# EAGLE design ring (EAGLE 7.5.0)
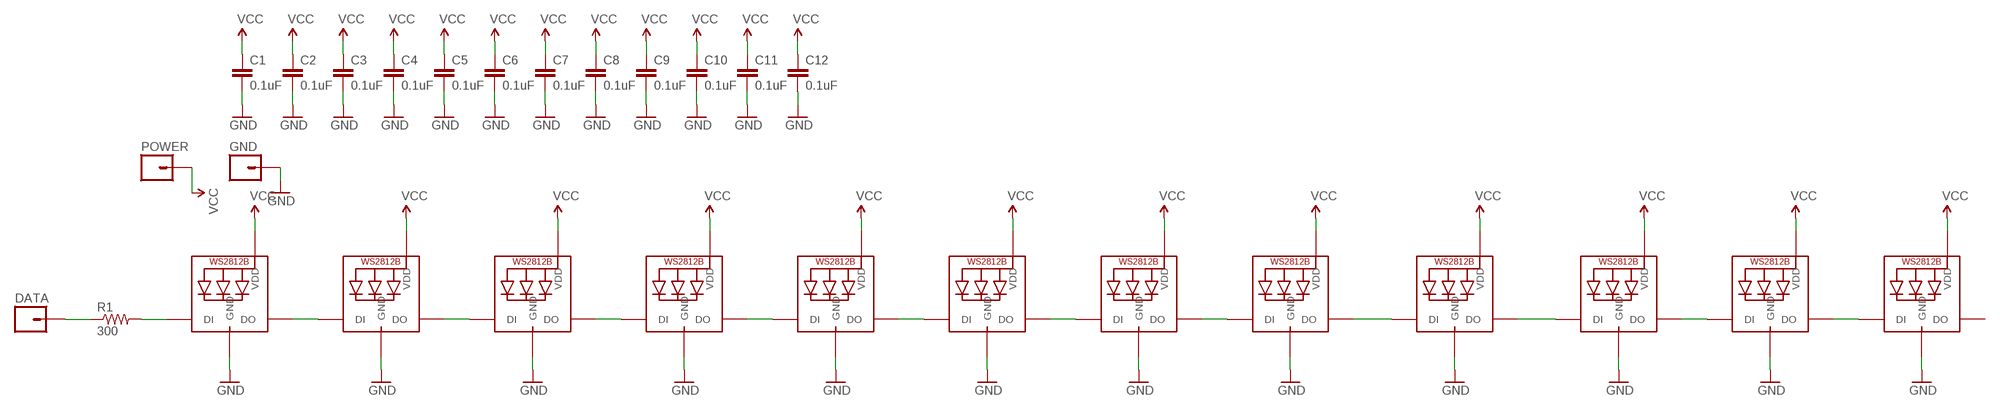
[diagram p0: schematic, sheet 1]

## Parts
C1  0.1uF  0.1UF-25V-5%(0603)  [0603-CAP]
C2  0.1uF  0.1UF-25V-5%(0603)  [0603-CAP]
C3  0.1uF  0.1UF-25V-5%(0603)  [0603-CAP]
C4  0.1uF  0.1UF-25V-5%(0603)  [0603-CAP]
C5  0.1uF  0.1UF-25V-5%(0603)  [0603-CAP]
C6  0.1uF  0.1UF-25V-5%(0603)  [0603-CAP]
C7  0.1uF  0.1UF-25V-5%(0603)  [0603-CAP]
C8  0.1uF  0.1UF-25V-5%(0603)  [0603-CAP]
C9  0.1uF  0.1UF-25V-5%(0603)  [0603-CAP]
C10  0.1uF  0.1UF-25V-5%(0603)  [0603-CAP]
C11  0.1uF  0.1UF-25V-5%(0603)  [0603-CAP]
C12  0.1uF  0.1UF-25V-5%(0603)  [0603-CAP]
DATA  M01PTH  [1X01]
GND  M01PTH  [1X01]
LED1  WS2812B5050  [WS2812B]
LED2  WS2812B5050  [WS2812B]
LED3  WS2812B5050  [WS2812B]
LED4  WS2812B5050  [WS2812B]
LED5  WS2812B5050  [WS2812B]
LED6  WS2812B5050  [WS2812B]
LED7  WS2812B5050  [WS2812B]
LED8  WS2812B5050  [WS2812B]
LED9  WS2812B5050  [WS2812B]
LED10  WS2812B5050  [WS2812B]
LED11  WS2812B5050  [WS2812B]
LED12  WS2812B5050  [WS2812B]
POWER  M01PTH  [1X01]
R1  300  300OHM-1/10W-1%(0603)  [0603-RES]

## Nets
GND: C1.2 C2.2 C3.2 C4.2 C5.2 C6.2 C7.2 C8.2 C9.2 C10.2 C11.2 C12.2 GND.1 LED1.3-GND(GND) LED2.3-GND(GND) LED3.3-GND(GND) LED4.3-GND(GND) LED5.3-GND(GND) LED6.3-GND(GND) LED7.3-GND(GND) LED8.3-GND(GND) LED9.3-GND(GND) LED10.3-GND(GND) LED11.3-GND(GND) LED12.3-GND(GND)
N$1: LED1.4-DIN(DI) R1.2
N$2: DATA.1 R1.1
N$3: LED1.2-DOUT(DO) LED2.4-DIN(DI)
N$4: LED2.2-DOUT(DO) LED3.4-DIN(DI)
N$5: LED3.2-DOUT(DO) LED4.4-DIN(DI)
N$6: LED4.2-DOUT(DO) LED5.4-DIN(DI)
N$7: LED5.2-DOUT(DO) LED6.4-DIN(DI)
N$8: LED6.2-DOUT(DO) LED7.4-DIN(DI)
N$9: LED7.2-DOUT(DO) LED8.4-DIN(DI)
N$10: LED8.2-DOUT(DO) LED9.4-DIN(DI)
N$11: LED9.2-DOUT(DO) LED10.4-DIN(DI)
N$12: LED10.2-DOUT(DO) LED11.4-DIN(DI)
N$13: LED11.2-DOUT(DO) LED12.4-DIN(DI)
VCC: C1.1 C2.1 C3.1 C4.1 C5.1 C6.1 C7.1 C8.1 C9.1 C10.1 C11.1 C12.1 LED1.1-VDD(VDD) LED2.1-VDD(VDD) LED3.1-VDD(VDD) LED4.1-VDD(VDD) LED5.1-VDD(VDD) LED6.1-VDD(VDD) LED7.1-VDD(VDD) LED8.1-VDD(VDD) LED9.1-VDD(VDD) LED10.1-VDD(VDD) LED11.1-VDD(VDD) LED12.1-VDD(VDD) POWER.1
Unconnected: LED12.2-DOUT(DO)

## Library data of the parts
C1-C12 = SparkFun-Capacitors:0.1UF-25V-5%(0603): CAP-08604; PROD_ID: CAP-08604
DATA GND POWER = SparkFun-Connectors:M01: Header 1 Standard 1-pin 0.1" header. Use with straight break away headers (SKU : PRT-00116), right angle break away headers (PRT-00553), swiss pins (PRT-00743), machine pins (PRT-00117), and female headers (PRT-00115). SMTSO-256-ET is a "flush mount" nut for a 4-40 screw. The older package used to be too tight, and did not allow it to sit properly thru the drill hit. The latest (0.165DIA) fits nice and snug.
LED1-LED12 = adafruit:WS2812B
R1 = SparkFun-Resistors:300OHM-1/10W-1%(0603): RES-10328; PROD_ID: RES_10328

## Board
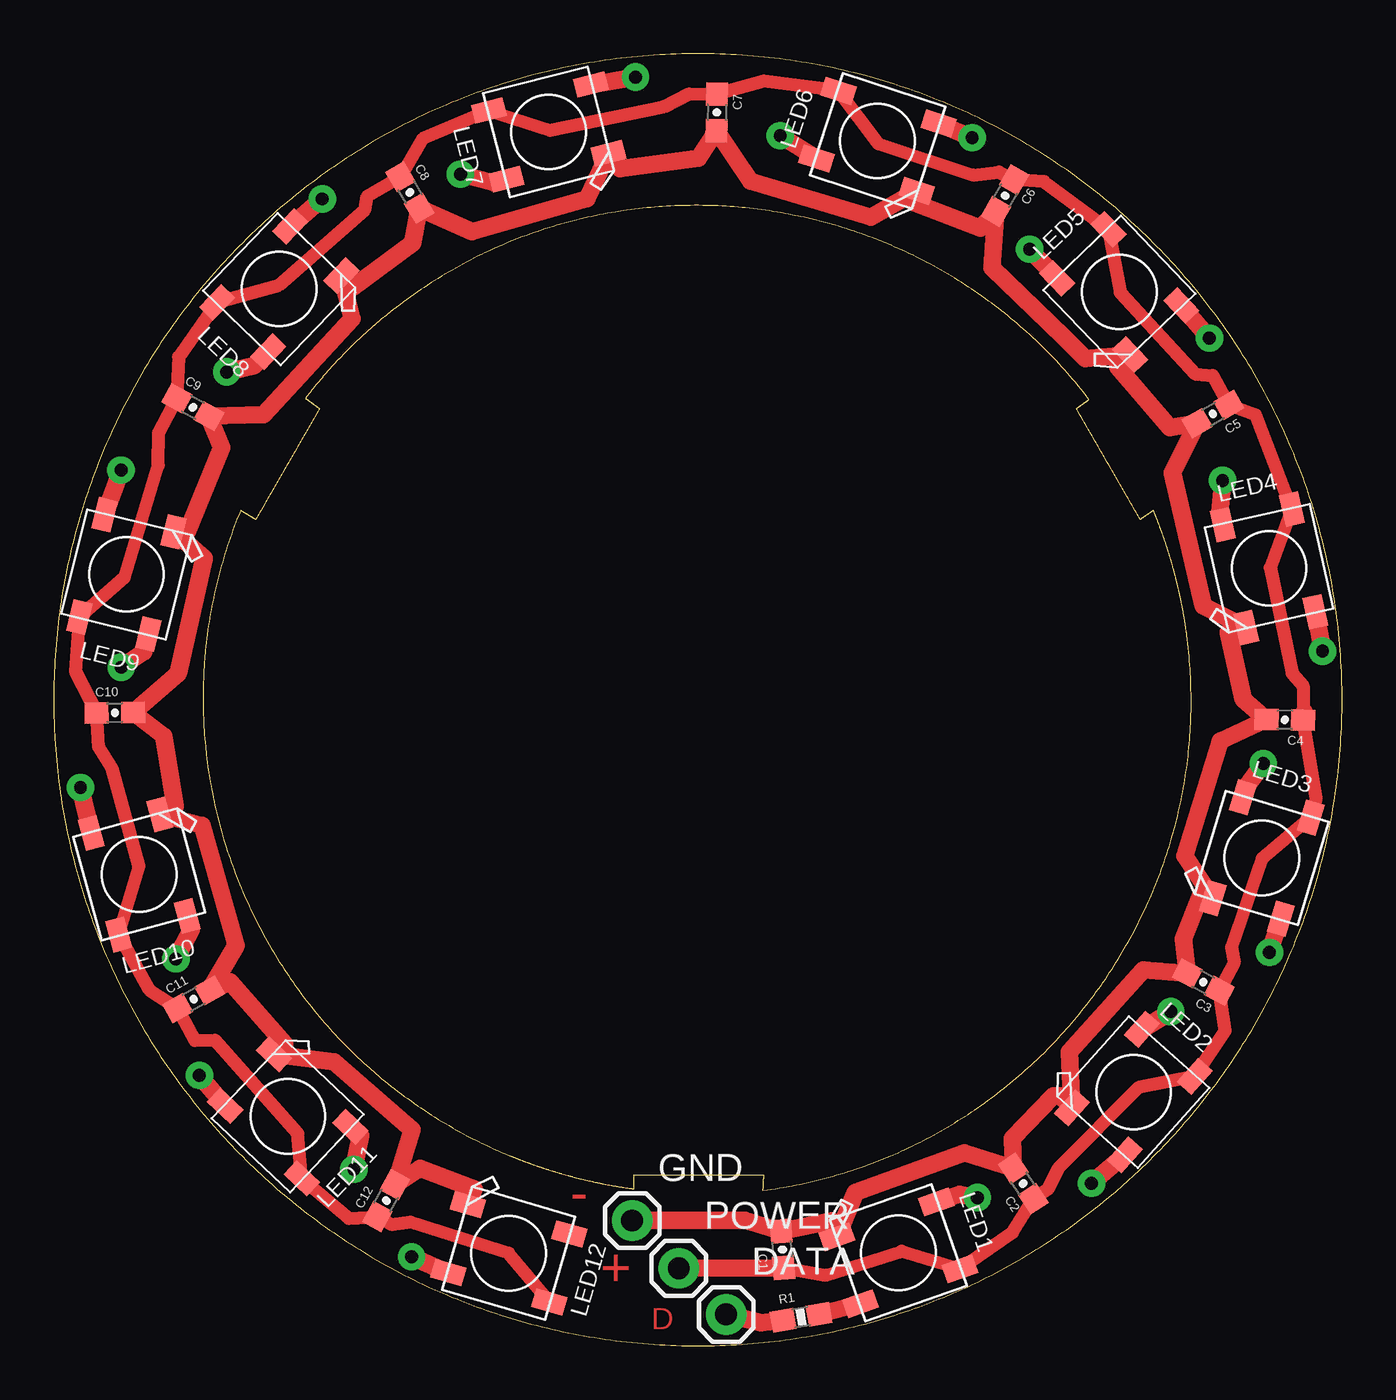
[diagram p1: board, top side]
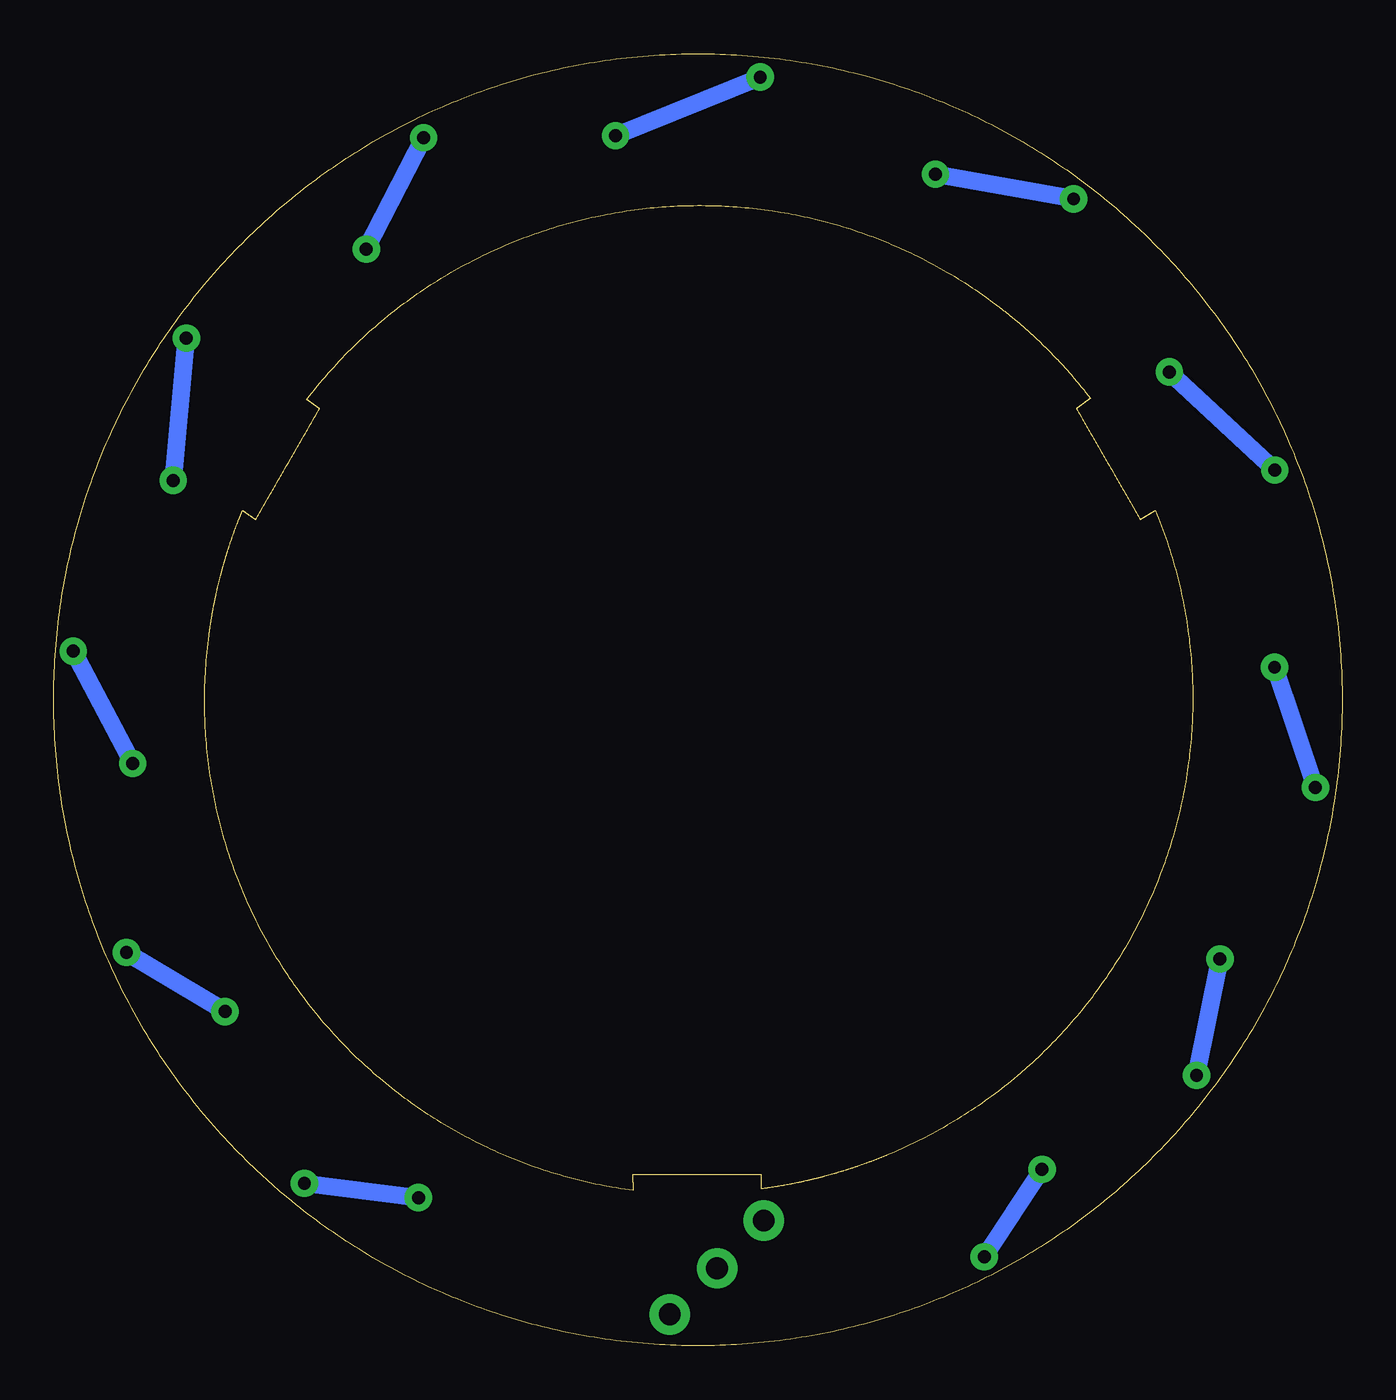
[diagram p2: board, bottom side, seen from below]

Size 59.94 x 60.11 mm. Coordinates in mm from the lower left corner, seen from the top.
Outline: 52.72,33.06 52.72,33.09 52.71,33.12 52.71,33.15 52.7,33.18 52.7,33.21 52.69,33.24 52.68,33.34 52.68,33.37 52.67,33.4 52.67,33.43 52.66,33.46 52.66,33.49 52.65,33.52 52.65,33.56 52.64,33.59 52.64,33.62 52.63,33.65 52.63,33.68 52.62,33.71 52.62,33.74 52.61,33.77 52.6,33.83 52.6,33.87 52.59,33.9 52.59,33.93 52.58,33.96 52.58,33.99 52.57,34.02 52.57,34.05 52.56,34.08 52.56,34.11 52.55,34.14 52.54,34.18 52.54,34.21 52.53,34.24 52.53,34.27 52.52,34.3 52.52,34.33 52.51,34.36 52.5,34.39 52.5,34.42 52.49,34.45 52.49,34.48 52.48,34.51 52.47,34.55 52.47,34.58 52.46,34.61 52.45,34.64 52.45,34.67 52.44,34.7 52.44,34.73 52.43,34.76 52.42,34.79 52.42,34.82 52.41,34.85 52.4,34.88 52.4,34.91 52.39,34.95 52.38,34.98 52.38,35.01 52.37,35.04 52.36,35.07 52.36,35.1 52.35,35.13 52.34,35.16 52.34,35.19 52.33,35.22 52.32,35.25 52.31,35.31 52.29,35.37 52.29,35.4 52.28,35.44 52.27,35.47 52.26,35.5 52.26,35.53 52.25,35.56 52.24,35.59 52.23,35.62 52.23,35.65 52.22,35.68 52.21,35.71 52.2,35.74 52.2,35.77 52.19,35.8 52.18,35.83 52.17,35.86 52.16,35.89 52.16,35.92 52.15,35.95 52.14,35.98 52.13,36.01 52.12,36.04 52.12,36.07 52.11,36.1 52.1,36.13 52.09,36.16 52.07,36.23 52.06,36.26 52.06,36.29 52.05,36.32 52.04,36.35 52.02,36.41 52.01,36.44 52,36.47 52,36.5 51.99,36.53 51.98,36.56 51.97,36.59 51.95,36.65 51.94,36.68 51.93,36.71 51.92,36.74 51.92,36.77 51.91,36.8 51.9,36.83 51.89,36.86 51.88,36.89 51.87,36.92 51.86,36.95 51.85,36.98 51.84,37.01 51.83,37.04 51.82,37.07 51.81,37.1 51.8,37.13 51.79,37.16 51.78,37.19 51.77,37.22 51.76,37.25 51.74,37.31 51.73,37.34 51.67,37.52 51.66,37.54 51.65,37.57 51.64,37.6 51.63,37.63 51.62,37.66 51.6,37.72 51.59,37.75 51.58,37.78 51.57,37.81 51.56,37.84 51.55,37.87 51.54,37.9 51.53,37.93 51.52,37.96 51.51,37.99 51.5,38.02 51.48,38.05 51.47,38.08 51.46,38.11 51.45,38.14 51.43,38.2 51.42,38.22 51.41,38.25 51.4,38.28 51.37,38.34 51.36,38.37 51.34,38.43 51.33,38.46 51.32,38.49 51.3,38.52 51.29,38.55 51.28,38.58 51.27,38.61 51.26,38.63 51.25,38.66 51.23,38.69 51.22,38.72 51.21,38.75 51.2,38.78 51.19,38.81 51.18,38.84 51.16,38.87 51.15,38.86 51.14,38.85 51.13,38.85 51.12,38.84 51.12,38.83 51.11,38.83 51.1,38.82 51.09,38.81 51.07,38.8 51.06,38.79 51.05,38.79 51.03,38.77 51.02,38.77 51.01,38.76 51,38.75 50.99,38.75 50.96,38.73 50.95,38.72 50.94,38.71 50.92,38.7 50.91,38.69 50.9,38.69 50.89,38.68 50.88,38.67 50.86,38.66 50.85,38.65 50.84,38.65 50.81,38.62 50.8,38.61 50.77,38.59 50.76,38.59 50.75,38.58 50.74,38.57 50.73,38.57 50.72,38.56 50.71,38.55 50.7,38.55 50.69,38.54 50.68,38.53 50.66,38.52 50.65,38.51 50.64,38.51 50.63,38.5 50.61,38.49 50.6,38.48 50.59,38.47 50.58,38.47 50.56,38.45 50.55,38.44 50.5,38.52 50.45,38.6 50.41,38.68 50.36,38.76 50.31,38.84 50.22,39 50.18,39.08 50.13,39.16 50.04,39.33 49.99,39.41 49.94,39.49 49.85,39.65 49.8,39.73 49.76,39.81 49.71,39.89 49.67,39.97 49.62,40.05 49.57,40.13 49.48,40.29 49.43,40.38 49.39,40.46 49.34,40.54 49.3,40.62 49.25,40.7 49.2,40.78 49.11,40.94 49.06,41.02 49.02,41.1 48.92,41.26 48.88,41.34 48.83,41.42 48.79,41.51 48.74,41.59 48.65,41.75 48.6,41.83 48.55,41.91 48.51,41.99 48.46,42.07 48.37,42.23 48.32,42.31 48.28,42.39 48.23,42.47 48.18,42.55 48.14,42.64 48.09,42.72 48,42.88 47.95,42.96 47.91,43.04 47.81,43.2 47.77,43.28 47.68,43.44 47.63,43.52 47.58,43.6 47.59,43.61 47.6,43.62 47.61,43.62 47.62,43.63 47.63,43.64 47.64,43.64 47.65,43.65 47.66,43.66 47.67,43.66 47.67,43.67 47.68,43.68 47.69,43.68 47.7,43.69 47.71,43.7 47.72,43.7 47.73,43.71 47.74,43.72 47.75,43.72 47.76,43.73 47.77,43.74 47.78,43.74 47.78,43.75 47.79,43.76 47.8,43.76 47.81,43.77 47.82,43.78 47.83,43.78 47.84,43.79 47.85,43.8 47.86,43.8 47.87,43.81 47.88,43.82 47.89,43.82 47.9,43.83 47.9,43.84 47.91,43.84 47.92,43.85 47.93,43.86 47.94,43.86 47.95,43.87 47.96,43.88 47.97,43.88 47.98,43.89 47.99,43.9 48,43.9 48.01,43.91 48.02,43.92 48.02,43.92 48.03,43.93 48.04,43.94 48.05,43.94 48.06,43.95 48.07,43.96 48.08,43.96 48.09,43.97 48.1,43.98 48.11,43.98 48.12,43.99 48.13,44 48.14,44 48.14,44.01 48.15,44.02 48.16,44.02 48.17,44.03 48.05,44.19 47.93,44.34 47.8,44.5 47.68,44.65 47.55,44.8 47.43,44.95 47.3,45.1 47.17,45.25 47.04,45.39 46.91,45.54 46.78,45.68 46.64,45.82 46.51,45.97 46.38,46.11 46.24,46.24 46.1,46.38 45.97,46.52 45.83,46.65 45.69,46.78 45.55,46.91 45.41,47.04 45.26,47.17 45.12,47.3 44.98,47.43 44.83,47.55 44.69,47.67 44.54,47.8 44.39,47.92 44.24,48.04 44.09,48.15 43.94,48.27 43.79,48.39 43.64,48.5 43.49,48.61 43.34,48.72 43.18,48.83 43.03,48.94 42.87,49.05 42.72,49.15 42.56,49.26 42.4,49.36 42.25,49.46 42.09,49.56 41.93,49.66 41.77,49.76 41.61,49.85 41.44,49.95 41.28,50.04 41.12,50.13 40.96,50.22 40.79,50.31 40.63,50.4 40.46,50.49 40.13,50.65 39.96,50.74 39.8,50.82 39.63,50.9 39.46,50.97 39.29,51.05 39.12,51.13 38.95,51.2 38.78,51.27 38.61,51.34 38.44,51.41 38.27,51.48 38.09,51.55 37.92,51.61 37.75,51.67 37.57,51.74 37.4,51.8 37.22,51.86 37.05,51.91 36.87,51.97 36.7,52.03 36.52,52.08 36.34,52.13 35.99,52.23 35.81,52.28 35.63,52.33 35.45,52.37 35.27,52.42 35.1,52.46 34.92,52.5 34.74,52.54 34.38,52.61 34.2,52.65 34.01,52.68 33.83,52.71 33.65,52.75 33.47,52.77 33.29,52.8 33.11,52.83 32.92,52.85 32.74,52.88 32.56,52.9 32.38,52.92 32.19,52.94 32.01,52.96 31.83,52.97 31.65,52.99 31.46,53 31.28,53.01 31.09,53.02 30.91,53.03 30.73,53.04 30.54,53.05 30.36,53.05 30.18,53.05 29.99,53.06 29.81,53.06 29.62,53.05 29.44,53.05 29.26,53.05 29.07,53.04 28.89,53.04 28.7,53.03 28.52,53.02 28.33,53.01 28.15,52.99 27.97,52.98 27.78,52.96 27.6,52.94 27.42,52.92 27.23,52.9 27.05,52.88 26.87,52.86 26.68,52.83 26.5,52.81 26.13,52.75 25.95,52.72 25.77,52.69 25.59,52.65 25.4,52.62 25.22,52.58 25.04,52.54 24.86,52.5 24.68,52.46 24.5,52.42 24.31,52.37 23.95,52.28 23.77,52.23 23.59,52.18 23.41,52.13 23.24,52.08 23.06,52.02 22.88,51.96 22.7,51.91 22.52,51.85 22.34,51.78 22.17,51.72 21.99,51.66 21.81,51.59 21.64,51.53 21.46,51.46 21.29,51.39 21.11,51.31 20.94,51.24 20.76,51.17 20.59,51.09 20.24,50.93 20.07,50.85 19.9,50.77 19.73,50.69 19.56,50.6 19.39,50.51 19.22,50.42 19.05,50.33 18.88,50.24 18.71,50.15 18.55,50.05 18.38,49.96 18.21,49.86 18.05,49.76 17.88,49.66 17.72,49.56 17.55,49.45 17.39,49.35 17.23,49.24 17.06,49.13 16.9,49.02 16.74,48.91 16.58,48.79 16.26,48.56 16.11,48.44 15.95,48.32 15.92,48.3 15.9,48.29 15.87,48.27 15.85,48.25 15.82,48.23 15.8,48.21 15.77,48.19 15.75,48.17 15.73,48.15 15.7,48.13 15.68,48.11 15.65,48.09 15.63,48.07 15.6,48.05 15.58,48.03 15.55,48.01 15.53,47.99 15.48,47.96 15.46,47.94 15.43,47.92 15.41,47.9 15.38,47.88 15.33,47.84 15.24,47.76 15.21,47.74 15.19,47.72 15.17,47.7 15.12,47.66 15.09,47.64 15.07,47.61 15.05,47.59 15.02,47.57 15,47.55 14.98,47.53 14.95,47.51 14.93,47.49 14.9,47.47 14.88,47.45 14.86,47.43 14.83,47.41 14.81,47.39 14.79,47.37 14.76,47.35 14.74,47.33 14.72,47.31 14.69,47.29 14.67,47.27 14.65,47.25 14.62,47.22 14.6,47.2 14.58,47.18 14.55,47.16 14.53,47.14 14.51,47.12 14.46,47.08 14.44,47.06 14.41,47.04 14.39,47.01 14.37,46.99 14.34,46.97 14.32,46.95 14.3,46.93 14.28,46.91 14.25,46.89 14.23,46.86 14.21,46.84 14.18,46.82 14.14,46.78 14.12,46.76 14.09,46.74 14.07,46.71 14.05,46.69 14.03,46.67 14,46.65 13.98,46.63 13.96,46.61 13.94,46.58 13.91,46.56 13.89,46.54 13.87,46.52 13.85,46.5 13.82,46.47 13.8,46.45 13.78,46.43 13.76,46.41 13.74,46.39 13.69,46.34 13.67,46.32 13.65,46.3 13.62,46.28 13.6,46.25 13.58,46.23 13.56,46.21 13.54,46.19 13.52,46.16 13.49,46.14 13.47,46.12 13.45,46.1 13.43,46.07 13.41,46.05 13.34,45.98 13.32,45.96 13.3,45.94 13.28,45.92 13.26,45.89 13.23,45.87 13.21,45.85 13.19,45.82 13.17,45.8 13.13,45.76 13.11,45.73 13.08,45.71 13.04,45.66 13.02,45.64 13,45.62 12.98,45.6 12.96,45.57 12.94,45.55 12.92,45.53 12.89,45.5 12.87,45.48 12.85,45.46 12.83,45.43 12.81,45.41 12.79,45.39 12.77,45.36 12.75,45.34 12.73,45.32 12.71,45.29 12.69,45.27 12.67,45.25 12.65,45.22 12.62,45.2 12.6,45.17 12.58,45.15 12.56,45.13 12.54,45.1 12.52,45.08 12.5,45.06 12.48,45.03 12.46,45.01 12.44,44.98 12.42,44.96 12.4,44.94 12.38,44.91 12.36,44.89 12.34,44.86 12.32,44.84 12.3,44.82 12.28,44.79 12.26,44.77 12.24,44.74 12.22,44.72 12.12,44.6 12.1,44.57 12.08,44.55 12.06,44.53 12.02,44.48 12,44.45 11.96,44.4 11.94,44.38 11.92,44.35 11.91,44.33 11.89,44.3 11.87,44.28 11.85,44.26 11.83,44.23 11.81,44.21 11.79,44.18 11.77,44.16 11.75,44.13 11.73,44.11 11.71,44.08 11.72,44.07 11.73,44.07 11.74,44.06 11.75,44.05 11.76,44.04 11.77,44.04 11.78,44.03 11.8,44.01 11.81,44.01 11.82,44 11.83,43.99 11.84,43.98 11.85,43.98 11.86,43.97 11.88,43.96 11.89,43.95 11.9,43.95 11.91,43.94 11.92,43.93 11.93,43.92 11.94,43.92 11.95,43.91 11.96,43.9 11.97,43.89 11.98,43.89 11.99,43.88 12,43.87 12.01,43.86 12.02,43.86 12.03,43.85 12.04,43.84 12.05,43.84 12.06,43.83 12.07,43.82 12.08,43.81 12.09,43.81 12.1,43.8 12.11,43.79 12.12,43.78 12.13,43.78 12.14,43.77 12.15,43.76 12.16,43.75 12.17,43.75 12.18,43.74 12.19,43.73 12.2,43.72 12.21,43.72 12.22,43.71 12.23,43.7 12.25,43.69 12.26,43.68 12.27,43.67 12.28,43.66 12.29,43.66 12.3,43.65 12.31,43.64 12.32,43.63 12.33,43.63 12.34,43.62 12.35,43.61 12.36,43.6 12.31,43.52 12.27,43.44 12.22,43.36 12.13,43.2 12.08,43.12 12.04,43.04 11.99,42.96 11.94,42.88 11.9,42.8 11.85,42.72 11.81,42.64 11.76,42.55 11.71,42.47 11.67,42.39 11.62,42.31 11.57,42.23 11.53,42.15 11.48,42.07 11.44,41.99 11.39,41.91 11.34,41.83 11.3,41.75 11.2,41.59 11.16,41.51 11.11,41.42 11.06,41.34 11.02,41.26 10.97,41.18 10.93,41.1 10.88,41.02 10.83,40.94 10.79,40.86 10.74,40.78 10.65,40.62 10.6,40.54 10.56,40.46 10.51,40.38 10.46,40.29 10.42,40.21 10.37,40.13 10.32,40.05 10.28,39.97 10.23,39.89 10.19,39.81 10.09,39.65 10.05,39.57 10,39.49 9.95,39.41 9.91,39.33 9.86,39.25 9.81,39.16 9.72,39 9.63,38.84 9.58,38.76 9.54,38.68 9.49,38.6 9.44,38.52 9.4,38.44 9.39,38.45 9.36,38.46 9.35,38.47 9.34,38.47 9.33,38.48 9.32,38.49 9.31,38.49 9.3,38.5 9.29,38.51 9.28,38.51 9.27,38.52 9.25,38.53 9.24,38.53 9.23,38.54 9.22,38.55 9.21,38.55 9.19,38.57 9.18,38.57 9.17,38.58 9.16,38.59 9.14,38.59 9.13,38.6 9.12,38.61 9.11,38.61 9.1,38.62 9.09,38.63 9.08,38.63 9.07,38.64 9.06,38.64 9.05,38.65 9.03,38.66 9.02,38.66 9.01,38.67 9,38.68 8.99,38.68 8.98,38.69 8.97,38.7 8.96,38.7 8.95,38.71 8.94,38.72 8.92,38.72 8.91,38.73 8.9,38.74 8.89,38.74 8.88,38.75 8.87,38.76 8.86,38.76 8.85,38.77 8.84,38.78 8.83,38.78 8.81,38.79 8.8,38.8 8.79,38.8 8.78,38.81 8.77,38.82 8.75,38.83 8.74,38.84 8.73,38.84 8.72,38.85 8.7,38.86 8.69,38.86 8.62,38.68 8.54,38.5 8.47,38.31 8.4,38.13 8.34,37.95 8.27,37.76 8.2,37.58 8.14,37.39 8.08,37.21 8.02,37.02 7.96,36.84 7.91,36.65 7.85,36.47 7.8,36.28 7.75,36.09 7.7,35.91 7.65,35.72 7.6,35.53 7.56,35.35 7.51,35.16 7.47,34.97 7.43,34.79 7.39,34.6 7.36,34.41 7.32,34.23 7.29,34.04 7.26,33.85 7.23,33.66 7.2,33.48 7.17,33.29 7.14,33.1 7.12,32.91 7.1,32.73 7.08,32.54 7.06,32.35 7.02,31.98 7.01,31.79 7,31.6 6.98,31.41 6.97,31.23 6.97,31.04 6.96,30.85 6.95,30.67 6.95,30.48 6.95,30.29 6.95,30.11 6.95,29.73 6.96,29.55 6.96,29.36 6.97,29.18 6.98,28.99 6.99,28.8 7,28.62 7.01,28.43 7.03,28.25 7.04,28.06 7.06,27.88 7.1,27.51 7.12,27.33 7.14,27.14 7.17,26.96 7.19,26.78 7.25,26.41 7.28,26.23 7.32,26.05 7.35,25.87 7.38,25.69 7.42,25.51 7.46,25.33 7.5,25.15 7.54,24.97 7.58,24.79 7.62,24.61 7.67,24.43 7.72,24.25 7.76,24.07 7.81,23.9 7.86,23.72 7.92,23.54 8.02,23.19 8.08,23.02 8.14,22.84 8.2,22.67 8.26,22.49 8.32,22.32 8.38,22.15 8.45,21.98 8.58,21.63 8.65,21.46 8.72,21.29 8.79,21.12 8.86,20.96 8.94,20.79 9.01,20.62 9.09,20.45 9.17,20.29 9.25,20.12 9.33,19.95 9.41,19.79 9.49,19.63 9.58,19.46 9.67,19.3 9.75,19.14 9.84,18.98 9.93,18.82 10.02,18.66 10.11,18.5 10.21,18.34 10.3,18.18 10.4,18.02 10.5,17.87 10.6,17.71 10.7,17.56 10.9,17.25 11,17.1 11.11,16.94 11.22,16.79 11.32,16.64 11.43,16.49 11.54,16.34 11.65,16.2 11.77,16.05 11.88,15.9 12,15.76 12.11,15.61 12.23,15.47 12.35,15.33 12.47,15.19 12.59,15.04 12.71,14.9 12.84,14.77 12.96,14.63 13.09,14.49 13.21,14.35 13.34,14.22 13.47,14.08 13.6,13.95 13.73,13.82 13.87,13.69 14,13.56 14.14,13.43 14.27,13.3 14.41,13.17 14.55,13.04 14.69,12.92 14.97,12.67 15.12,12.55 15.26,12.43 15.41,12.31 15.56,12.19 15.7,12.07 15.85,11.95 16,11.84 16.15,11.73 16.31,11.61 16.46,11.5 16.62,11.39 16.77,11.28 16.93,11.17 17.09,11.06 17.24,10.96 17.4,10.85 17.57,10.75 17.73,10.64 17.89,10.54 18.06,10.44 18.22,10.34 18.39,10.24 18.56,10.15 18.72,10.05 18.89,9.96 19.07,9.87 19.24,9.77 19.41,9.68 19.76,9.51 19.94,9.42 20.11,9.34 20.29,9.25 20.47,9.17 20.65,9.09 20.83,9.01 21.01,8.93 21.2,8.86 21.23,8.84 21.25,8.83 21.28,8.82 21.31,8.81 21.34,8.8 21.37,8.78 21.4,8.77 21.43,8.76 21.46,8.75 21.49,8.74 21.52,8.73 21.55,8.72 21.58,8.7 21.6,8.69 21.63,8.68 21.66,8.67 21.69,8.66 21.72,8.65 21.78,8.62 21.81,8.61 21.84,8.6 21.87,8.59 21.9,8.58 21.93,8.57 21.96,8.56 21.99,8.55 22.02,8.54 22.05,8.52 22.08,8.51 22.1,8.5 22.13,8.49 22.16,8.48 22.19,8.47 22.22,8.46 22.28,8.44 22.31,8.43 22.34,8.42 22.37,8.41 22.46,8.38 22.49,8.37 22.52,8.36 22.55,8.35 22.58,8.34 22.61,8.33 22.64,8.32 22.67,8.31 22.7,8.3 22.73,8.29 22.76,8.28 22.79,8.27 22.82,8.26 22.85,8.25 22.88,8.24 22.91,8.23 22.94,8.22 22.97,8.21 23,8.2 23.03,8.19 23.06,8.18 23.09,8.17 23.12,8.16 23.18,8.14 23.21,8.13 23.24,8.12 23.27,8.11 23.3,8.1 23.33,8.09 23.36,8.09 23.42,8.07 23.45,8.06 23.51,8.04 23.54,8.03 23.57,8.02 23.6,8.01 23.63,8.01 23.66,8 23.72,7.98 23.75,7.97 23.81,7.95 23.84,7.95 23.9,7.93 23.93,7.92 23.96,7.91 23.99,7.9 24.02,7.9 24.05,7.89 24.08,7.88 24.11,7.87 24.14,7.86 24.17,7.86 24.2,7.85 24.23,7.84 24.26,7.83 24.29,7.82 24.32,7.82 24.35,7.81 24.39,7.8 24.42,7.79 24.45,7.79 24.48,7.78 24.51,7.77 24.54,7.76 24.57,7.76 24.6,7.75 24.63,7.74 24.66,7.73 24.69,7.73 24.72,7.72 24.75,7.71 24.78,7.7 24.81,7.7 24.84,7.69 24.87,7.68 24.9,7.68 24.93,7.67 24.97,7.66 25.03,7.65 25.06,7.64 25.09,7.63 25.12,7.63 25.15,7.62 25.18,7.62 25.21,7.61 25.24,7.6 25.27,7.6 25.3,7.59 25.33,7.58 25.36,7.58 25.4,7.57 25.43,7.56 25.46,7.56 25.49,7.55 25.52,7.55 25.55,7.54 25.58,7.53 25.61,7.53 25.64,7.52 25.67,7.51 25.7,7.51 25.77,7.5 25.8,7.49 25.83,7.49 25.86,7.48 25.92,7.47 25.95,7.46 25.98,7.46 26.01,7.45 26.04,7.45 26.11,7.44 26.14,7.43 26.17,7.43 26.2,7.42 26.23,7.42 26.26,7.41 26.29,7.4 26.32,7.4 26.35,7.39 26.38,7.39 26.42,7.38 26.45,7.38 26.48,7.38 26.51,7.37 26.54,7.37 26.6,7.36 26.63,7.35 26.66,7.35 26.7,7.34 26.73,7.34 26.76,7.33 26.79,7.33 26.82,7.32 26.85,7.32 26.88,7.32 26.91,7.31 26.94,7.31 26.98,7.3 27.01,7.3 27.01,7.31 27.01,7.41 27.01,7.42 27.01,7.43 27.01,7.54 27.01,7.55 27.01,7.56 27.01,7.7 27.01,7.71 27.01,7.72 27.01,7.82 27.01,7.83 27.01,7.85 27.01,7.95 27.01,7.96 33.02,7.96 33.02,7.95 33.02,7.94 33.02,7.92 33.02,7.91 33.02,7.9 33.02,7.89 33.02,7.88 33.02,7.87 33.01,7.86 33.01,7.84 33.01,7.83 33.01,7.82 33.01,7.81 33.01,7.8 33.01,7.79 33.01,7.78 33.01,7.76 33.01,7.75 33.01,7.74 33.01,7.72 33.01,7.71 33.01,7.7 33.01,7.68 33.01,7.67 33,7.66 33,7.65 33,7.64 33,7.62 33,7.6 33,7.59 33,7.58 33,7.57 33,7.56 33,7.55 33,7.53 33,7.52 33,7.51 33,7.5 33,7.49 33,7.48 32.99,7.47 32.99,7.44 32.99,7.43 32.99,7.42 32.99,7.41 32.99,7.4 32.99,7.39 32.99,7.37 32.99,7.36 32.99,7.35 32.99,7.34 32.99,7.33 32.99,7.31 32.99,7.29 32.99,7.28 32.99,7.27 32.98,7.26 32.98,7.25 32.98,7.24 32.98,7.23 33.18,7.25 33.37,7.28 33.57,7.31 33.76,7.34 33.96,7.37 34.34,7.44 34.53,7.48 34.72,7.52 34.92,7.56 35.1,7.6 35.29,7.65 35.48,7.69 35.67,7.74 35.86,7.79 36.04,7.84 36.23,7.89 36.41,7.95 36.6,8 36.78,8.05 36.96,8.11 37.15,8.17 37.33,8.23 37.69,8.36 37.87,8.42 38.04,8.49 38.22,8.55 38.4,8.62 38.57,8.69 38.75,8.76 38.92,8.84 39.27,8.99 39.44,9.06 39.61,9.14 39.78,9.22 39.95,9.3 40.12,9.39 40.29,9.47 40.46,9.55 40.62,9.64 40.79,9.73 40.95,9.82 41.12,9.91 41.28,10 41.44,10.09 41.6,10.19 41.76,10.28 41.92,10.38 42.08,10.48 42.24,10.58 42.39,10.68 42.55,10.78 42.7,10.88 42.86,10.98 43.01,11.09 43.16,11.19 43.31,11.3 43.46,11.41 43.61,11.52 43.76,11.63 43.91,11.74 44.05,11.86 44.2,11.97 44.34,12.09 44.49,12.2 44.63,12.32 44.77,12.44 44.91,12.56 45.05,12.68 45.19,12.8 45.32,12.92 45.46,13.05 45.6,13.17 45.73,13.3 45.86,13.43 46.13,13.68 46.26,13.82 46.39,13.95 46.51,14.08 46.64,14.21 46.77,14.35 46.89,14.48 47.01,14.62 47.14,14.76 47.26,14.89 47.38,15.03 47.5,15.17 47.61,15.31 47.73,15.46 47.85,15.6 47.96,15.74 48.07,15.89 48.3,16.18 48.41,16.33 48.52,16.48 48.62,16.62 48.73,16.77 48.84,16.93 48.94,17.08 49.04,17.23 49.14,17.38 49.24,17.54 49.34,17.69 49.44,17.85 49.54,18.01 49.63,18.16 49.73,18.32 49.82,18.48 49.91,18.64 50,18.8 50.09,18.96 50.18,19.12 50.27,19.29 50.35,19.45 50.44,19.61 50.52,19.78 50.6,19.94 50.68,20.11 50.76,20.28 50.84,20.45 50.91,20.61 50.99,20.78 51.06,20.95 51.13,21.12 51.2,21.29 51.28,21.47 51.34,21.64 51.41,21.81 51.48,21.99 51.54,22.16 51.6,22.33 51.66,22.51 51.72,22.69 51.78,22.86 51.84,23.04 51.9,23.22 51.95,23.4 52,23.57 52.05,23.75 52.15,24.11 52.2,24.3 52.25,24.48 52.29,24.66 52.33,24.84 52.37,25.02 52.42,25.21 52.45,25.39 52.49,25.58 52.53,25.76 52.56,25.95 52.59,26.13 52.62,26.32 52.65,26.51 52.68,26.69 52.71,26.88 52.73,27.07 52.76,27.26 52.78,27.44 52.8,27.63 52.82,27.82 52.84,28.01 52.85,28.2 52.86,28.39 52.88,28.59 52.89,28.78 52.9,28.97 52.91,29.16 52.91,29.35 52.92,29.55 52.92,29.74 52.92,29.93 52.92,30.12 52.92,30.32 52.92,30.51 52.91,30.71 52.9,30.9 52.9,31.1 52.88,31.29 52.87,31.49 52.86,31.68 52.84,31.88 52.83,32.07 52.81,32.27 52.79,32.47 52.77,32.66 52.75,32.86 52.72,33.06
Outline: 29.71,60.11 29.46,60.11 29.2,60.1 28.94,60.1 28.68,60.09 28.43,60.07 28.17,60.06 27.92,60.04 27.67,60.03 27.41,60.01 27.16,59.98 26.91,59.96 26.66,59.93 26.4,59.9 26.15,59.87 25.9,59.84 25.66,59.8 25.41,59.77 25.16,59.73 24.91,59.69 24.67,59.64 24.42,59.6 24.18,59.55 23.93,59.5 23.69,59.45 23.44,59.4 23.2,59.34 22.96,59.29 22.72,59.23 22.24,59.11 22,59.04 21.77,58.97 21.53,58.91 21.29,58.84 21.06,58.76 20.82,58.69 20.59,58.61 20.36,58.53 20.13,58.46 19.9,58.37 19.67,58.29 19.44,58.21 19.21,58.12 18.98,58.03 18.75,57.94 18.53,57.85 18.31,57.75 18.08,57.66 17.86,57.56 17.64,57.46 17.42,57.36 17.2,57.26 16.98,57.15 16.76,57.04 16.54,56.94 16.33,56.83 16.11,56.71 15.9,56.6 15.69,56.49 15.47,56.37 15.26,56.25 15.05,56.13 14.84,56.01 14.64,55.89 14.43,55.76 14.22,55.64 14.02,55.51 13.82,55.38 13.61,55.25 13.41,55.11 13.21,54.98 13.01,54.85 12.82,54.71 12.62,54.57 12.43,54.43 12.23,54.29 12.04,54.14 11.85,54 11.66,53.85 11.47,53.7 11.28,53.55 11.09,53.4 10.72,53.1 10.54,52.94 10.36,52.78 10.18,52.63 10,52.47 9.82,52.31 9.64,52.14 9.47,51.98 9.12,51.65 8.95,51.48 8.78,51.31 8.61,51.14 8.44,50.97 8.28,50.79 8.11,50.62 7.95,50.44 7.79,50.27 7.62,50.09 7.47,49.91 7.31,49.73 7.15,49.54 7,49.36 6.84,49.18 6.69,48.99 6.54,48.8 6.24,48.42 6.1,48.23 5.95,48.04 5.81,47.85 5.67,47.65 5.53,47.46 5.39,47.26 5.25,47.06 4.98,46.66 4.85,46.46 4.72,46.26 4.59,46.05 4.46,45.85 4.34,45.64 4.21,45.44 4.09,45.23 3.97,45.02 3.85,44.81 3.73,44.6 3.5,44.17 3.39,43.96 3.28,43.74 3.17,43.52 3.06,43.31 2.96,43.09 2.85,42.87 2.75,42.65 2.65,42.43 2.55,42.2 2.45,41.98 2.36,41.76 2.26,41.53 2.17,41.31 2.08,41.08 1.99,40.85 1.9,40.62 1.82,40.39 1.73,40.16 1.65,39.93 1.57,39.7 1.5,39.46 1.42,39.23 1.35,38.99 1.27,38.76 1.2,38.52 1.14,38.29 1.07,38.05 1.01,37.81 0.94,37.57 0.88,37.33 0.82,37.09 0.77,36.84 0.71,36.6 0.66,36.36 0.61,36.11 0.56,35.87 0.51,35.62 0.47,35.38 0.42,35.13 0.38,34.88 0.35,34.63 0.31,34.39 0.27,34.14 0.24,33.88 0.21,33.63 0.18,33.38 0.15,33.13 0.13,32.88 0.11,32.62 0.09,32.37 0.07,32.11 0.05,31.86 0.04,31.6 0.03,31.35 0.02,31.09 0.01,30.83 0,30.57 0,30.32 0,29.8 0,29.54 0.01,29.28 0.02,29.02 0.03,28.77 0.05,28.25 0.07,28 0.09,27.74 0.11,27.49 0.13,27.24 0.18,26.73 0.21,26.48 0.24,26.23 0.27,25.98 0.31,25.73 0.35,25.48 0.38,25.23 0.42,24.98 0.47,24.74 0.51,24.49 0.56,24.24 0.61,24 0.66,23.75 0.71,23.51 0.77,23.27 0.82,23.03 0.88,22.79 0.94,22.55 1.01,22.3 1.07,22.07 1.14,21.83 1.2,21.59 1.27,21.35 1.35,21.12 1.42,20.88 1.5,20.65 1.57,20.42 1.65,20.18 1.73,19.95 1.82,19.72 1.9,19.49 1.99,19.26 2.08,19.04 2.17,18.81 2.26,18.58 2.36,18.36 2.45,18.13 2.55,17.91 2.65,17.69 2.75,17.47 2.85,17.24 2.96,17.03 3.06,16.81 3.17,16.59 3.28,16.37 3.39,16.16 3.5,15.94 3.62,15.73 3.73,15.52 3.85,15.31 3.97,15.1 4.09,14.89 4.21,14.68 4.34,14.47 4.46,14.26 4.59,14.06 4.72,13.86 4.85,13.65 4.98,13.45 5.25,13.05 5.39,12.85 5.53,12.66 5.67,12.46 5.81,12.27 5.95,12.07 6.1,11.88 6.24,11.69 6.39,11.5 6.54,11.31 6.69,11.12 6.84,10.94 7,10.75 7.15,10.57 7.31,10.39 7.47,10.21 7.62,10.03 7.79,9.85 7.95,9.67 8.11,9.49 8.28,9.32 8.44,9.15 8.61,8.97 8.78,8.8 8.95,8.63 9.12,8.47 9.29,8.3 9.47,8.13 9.64,7.97 9.82,7.81 10,7.65 10.18,7.49 10.36,7.33 10.54,7.17 10.72,7.02 11.09,6.71 11.28,6.56 11.47,6.41 11.66,6.26 11.85,6.12 12.04,5.97 12.23,5.83 12.43,5.69 12.62,5.55 12.82,5.41 13.01,5.27 13.21,5.13 13.41,5 13.61,4.87 13.82,4.73 14.02,4.6 14.22,4.48 14.43,4.35 14.64,4.23 14.84,4.1 15.05,3.98 15.26,3.86 15.47,3.74 15.69,3.63 15.9,3.51 16.11,3.4 16.33,3.29 16.54,3.18 16.76,3.07 16.98,2.96 17.2,2.86 17.42,2.76 17.64,2.66 17.86,2.55 18.08,2.46 18.31,2.36 18.53,2.27 18.75,2.17 18.98,2.08 19.21,2 19.44,1.91 19.67,1.82 19.9,1.74 20.13,1.66 20.36,1.58 20.59,1.5 20.82,1.42 21.06,1.35 21.29,1.28 21.53,1.21 21.77,1.14 22,1.07 22.24,1.01 22.48,0.95 22.72,0.88 22.96,0.83 23.2,0.77 23.44,0.71 23.69,0.66 23.93,0.61 24.18,0.56 24.42,0.51 24.67,0.47 24.91,0.43 25.16,0.38 25.41,0.35 25.66,0.31 25.9,0.27 26.15,0.24 26.4,0.21 26.66,0.18 26.91,0.15 27.16,0.13 27.41,0.11 27.67,0.09 27.92,0.07 28.17,0.05 28.43,0.04 28.68,0.03 28.94,0.02 29.2,0.01 29.46,0 29.71,0 30.23,0 30.49,0 30.75,0.01 31,0.02 31.26,0.03 31.51,0.04 31.77,0.05 32.02,0.07 32.28,0.09 32.53,0.11 32.78,0.13 33.04,0.15 33.29,0.18 33.54,0.21 33.79,0.24 34.04,0.27 34.29,0.31 34.78,0.38 35.03,0.43 35.28,0.47 35.52,0.51 35.77,0.56 36.01,0.61 36.26,0.66 36.5,0.71 36.74,0.77 36.98,0.83 37.22,0.88 37.46,0.95 37.7,1.01 37.94,1.07 38.18,1.14 38.41,1.21 38.65,1.28 38.88,1.35 39.12,1.42 39.35,1.5 39.58,1.58 39.82,1.66 40.05,1.74 40.28,1.82 40.51,1.91 40.73,2 40.96,2.08 41.19,2.17 41.41,2.27 41.86,2.46 42.09,2.55 42.53,2.76 42.75,2.86 42.97,2.96 43.18,3.07 43.4,3.18 43.62,3.29 43.83,3.4 44.05,3.51 44.26,3.63 44.47,3.74 44.68,3.86 44.89,3.98 45.1,4.1 45.31,4.23 45.51,4.35 45.72,4.48 45.92,4.6 46.13,4.73 46.33,4.87 46.53,5 46.73,5.13 46.93,5.27 47.13,5.41 47.32,5.55 47.52,5.69 47.71,5.83 48.1,6.12 48.29,6.26 48.48,6.41 48.66,6.56 48.85,6.71 49.22,7.02 49.4,7.17 49.77,7.49 49.95,7.65 50.3,7.97 50.48,8.13 50.65,8.3 50.82,8.47 51,8.63 51.16,8.8 51.33,8.97 51.5,9.15 51.67,9.32 51.83,9.49 52,9.67 52.16,9.85 52.32,10.03 52.48,10.21 52.63,10.39 52.79,10.57 52.95,10.75 53.1,10.94 53.25,11.12 53.4,11.31 53.55,11.5 53.7,11.69 53.85,11.88 53.99,12.07 54.13,12.27 54.27,12.46 54.41,12.66 54.55,12.85 54.69,13.05 54.82,13.25 54.96,13.45 55.09,13.65 55.22,13.86 55.35,14.06 55.48,14.26 55.6,14.47 55.73,14.68 55.85,14.89 55.97,15.1 56.09,15.31 56.21,15.52 56.33,15.73 56.44,15.94 56.55,16.16 56.66,16.37 56.77,16.59 56.88,16.81 56.99,17.03 57.09,17.24 57.2,17.47 57.3,17.69 57.4,17.91 57.49,18.13 57.59,18.36 57.68,18.58 57.78,18.81 57.87,19.04 57.95,19.26 58.04,19.49 58.13,19.72 58.21,19.95 58.29,20.18 58.37,20.42 58.45,20.65 58.52,20.88 58.6,21.12 58.67,21.35 58.74,21.59 58.87,22.07 58.94,22.3 59,22.55 59.06,22.79 59.12,23.03 59.18,23.27 59.23,23.51 59.29,23.75 59.34,24 59.38,24.24 59.43,24.49 59.48,24.74 59.52,24.98 59.56,25.23 59.6,25.48 59.64,25.73 59.67,25.98 59.7,26.23 59.73,26.48 59.76,26.73 59.81,27.24 59.84,27.49 59.86,27.74 59.88,28 59.89,28.25 59.9,28.51 59.92,28.77 59.93,29.02 59.93,29.28 59.94,29.54 59.94,29.8 59.94,30.32 59.94,30.57 59.93,30.83 59.93,31.09 59.92,31.35 59.9,31.6 59.89,31.86 59.88,32.11 59.86,32.37 59.84,32.62 59.81,32.88 59.79,33.13 59.76,33.38 59.73,33.63 59.7,33.88 59.67,34.14 59.64,34.39 59.6,34.63 59.56,34.88 59.52,35.13 59.48,35.38 59.43,35.62 59.38,35.87 59.34,36.11 59.29,36.36 59.23,36.6 59.18,36.84 59.12,37.09 59.06,37.33 59,37.57 58.94,37.81 58.87,38.05 58.81,38.29 58.74,38.52 58.67,38.76 58.6,38.99 58.52,39.23 58.45,39.46 58.29,39.93 58.21,40.16 58.13,40.39 58.04,40.62 57.95,40.85 57.87,41.08 57.78,41.31 57.68,41.53 57.59,41.76 57.49,41.98 57.4,42.2 57.3,42.43 57.2,42.65 57.09,42.87 56.99,43.09 56.88,43.31 56.77,43.52 56.66,43.74 56.55,43.96 56.44,44.17 56.33,44.38 56.21,44.6 56.09,44.81 55.97,45.02 55.85,45.23 55.73,45.44 55.6,45.64 55.48,45.85 55.35,46.05 55.22,46.26 55.09,46.46 54.96,46.66 54.82,46.86 54.69,47.06 54.55,47.26 54.41,47.46 54.27,47.65 54.13,47.85 53.99,48.04 53.85,48.23 53.7,48.42 53.55,48.61 53.4,48.8 53.25,48.99 52.95,49.36 52.79,49.54 52.63,49.73 52.48,49.91 52.32,50.09 52.16,50.27 52,50.44 51.83,50.62 51.67,50.79 51.5,50.97 51.33,51.14 51.16,51.31 51,51.48 50.82,51.65 50.65,51.81 50.48,51.98 50.3,52.14 50.12,52.31 49.95,52.47 49.77,52.63 49.59,52.78 49.4,52.94 49.22,53.1 48.85,53.4 48.66,53.55 48.48,53.7 48.29,53.85 48.1,54 47.71,54.29 47.52,54.43 47.32,54.57 47.13,54.71 46.93,54.85 46.73,54.98 46.53,55.11 46.33,55.25 46.13,55.38 45.92,55.51 45.72,55.64 45.51,55.76 45.31,55.89 45.1,56.01 44.89,56.13 44.68,56.25 44.47,56.37 44.26,56.49 44.05,56.6 43.83,56.71 43.4,56.94 43.18,57.04 42.97,57.15 42.75,57.26 42.53,57.36 42.31,57.46 42.09,57.56 41.86,57.66 41.41,57.85 41.19,57.94 40.96,58.03 40.73,58.12 40.51,58.21 40.28,58.29 40.05,58.37 39.82,58.46 39.58,58.53 39.35,58.61 39.12,58.69 38.88,58.76 38.65,58.84 38.41,58.91 37.94,59.04 37.7,59.11 37.22,59.23 36.98,59.29 36.74,59.34 36.5,59.4 36.26,59.45 36.01,59.5 35.77,59.55 35.52,59.6 35.28,59.64 35.03,59.69 34.78,59.73 34.54,59.77 34.29,59.8 34.04,59.84 33.79,59.87 33.54,59.9 33.29,59.93 33.04,59.96 32.78,59.98 32.53,60.01 32.28,60.03 32.02,60.04 31.77,60.06 31.51,60.07 31.26,60.09 31,60.1 30.75,60.1 30.49,60.11 30.23,60.11 29.71,60.11
Copper layers (1*16): Top 0.035mm / dielectric 1.5mm / Bottom 0.035mm
Design rules "default": minimum track width 10mil, minimum drill 24mil, track to track 8mil, track to pad 8mil, pad to pad 8mil, via to via 8mil, smd to smd 8mil, copper to edge 40mil, drill to drill 8mil, minimum pad ring 10mil, minimum via ring 8mil, stop-mask expansion 4mil, vias tented up to drill 0mil, thermal gap 10mil

### Footprints (pad centres in the part's own frame; a part is rotated, then mirrored left to right if it is on the bottom)
0603-CAP = smd 1.1 x 1: 1 -0.85,0; 2 0.85,0
1X01 = drill 1.016 pad 1.88: 1 0,0
WS2812B = smd 1.5 x 0.9: 1-VDD 2.45,-1.65; 2-DOUT 2.45,1.65; 3-GND -2.45,1.65; 4-DIN -2.45,-1.65
0603-RES = smd 1.1 x 1: 1 -0.85,0; 2 0.85,0

### Placement (x,y rotation side)
C1  33.9,4.49 94.2 top
C2  45.11,7.55 123.6 top
C3  53.49,16.92 152.2 top
C4  57.28,29.13 178.6 top
C5  53.94,43.35 209.9 top
C6  44.26,53.51 240 top
C7  30.85,57.39 268.7 top
C8  16.57,53.66 300.5 top
C9  6.47,43.66 331 top
C10  2.84,29.45 1 top
C11  6.51,16.12 29.1 top
C12  15.47,6.75 61.1 top
DATA  31.28,1.46 0 top
GND  26.91,5.83 0 top
LED1  39.31,4.33 19.3 top
LED2  50.24,11.8 48.3 top
LED3  56.21,22.69 73.4 top
LED4  56.55,36.18 102.8 top
LED5  49.57,49.03 133.7 top
LED6  38.33,56.06 161.9 top
LED7  23.03,56.48 194.3 top
LED8  10.49,49.17 226.1 top
LED9  3.38,35.89 256.1 top
LED10  3.98,21.93 285.2 top
LED11  10.89,10.67 316.6 top
LED12  21.17,4.31 343.8 top
POWER  29.08,3.6 0 top
R1  34.77,1.33 9.6 top

### Tracks (layer width: path | path; a pad name or v marks a point on that pad's centre or on a via)
GND
  Top 0.813: LED2.3-GND 47.25,13.67 50.7,17.5 C3.2 52.56,18.92 53.37,20.98 LED3.3-GND 52.63,22.79 54.27,28.13 C4.2 55.35,30.06 54.65,33.21 LED4.3-GND 53.49,34.43 52.05,40.62 C5.2 51.92,42.72 49.51,45.54 LED5.3-GND 48,45.93 46.99,46.93 43.65,50.17 C6.2 43.12,52.01 40.02,53.18 LED6.3-GND 38.03,52.52 32.42,54.19 C7.2 29.99,55.26 26.35,54.77 LED7.3-GND 24.82,53.38 19.45,51.84 C8.2 16.69,51.3 13.93,49.26 LED8.3-GND 13.88,47.78 9.77,43.33 C9.2 7.81,41.79 6.2,37.87 LED9.3-GND 6.99,36.64 5.79,31.28 C10.2 5.12,28.37 5.64,25.1 LED10.3-GND 6.9,24.22 8.49,18.62 C11.2 8.21,16.93 10.73,14.05 LED11.3-GND 13.05,13.2 16.67,10.05 C12.2 17.04,8.25 19.55,7.3 LED12.3-GND | GND.1 32.15,5.83 C1.2 36.2,5.82 LED1.3-GND 37.3,7.14 42.37,8.97 C2.2 44.6,9.66 46.5,11.62 46.83,11.62 LED2.3-GND | LED2.3-GND 47.26,11.77
N$1
  Top 0.813: R1.2 LED1.4-DIN
N$2
  Top 0.813: R1.1 32.91,1.07 DATA.1
N$3  (via drill 0.6 pad 1.27)
  Top 0.813: LED1.2-DOUT 42.14,7.05 v42.97,6.89 | v48.28,7.56 LED2.4-DIN
  Bottom 0.813: v42.97,6.89 v48.28,7.56
N$4  (via drill 0.6 pad 1.27)
  Top 0.813: LED2.2-DOUT 51.86,15.46 v51.97,15.55 | v56.56,18.3 LED3.4-DIN
  Bottom 0.813: v51.97,15.55 v56.56,18.3
N$5  (via drill 0.6 pad 1.27)
  Top 0.813: LED3.2-DOUT 55.46,25.98 v56.27,27.09 | v59.03,32.32 LED4.4-DIN
  Bottom 0.813: v56.27,27.09 v59.03,32.32
N$6  (via drill 0.6 pad 1.27)
  Top 0.813: LED4.2-DOUT 54.25,38.76 v54.38,40.26 | v53.77,46.88 LED5.4-DIN
  Bottom 0.813: v54.38,40.26 v53.77,46.88
N$7  (via drill 0.6 pad 1.27)
  Top 0.813: LED5.2-DOUT 46.75,49.62 v45.4,51.02 | v42.73,56.21 LED6.4-DIN
  Bottom 0.813: v45.4,51.02 v42.73,56.21
N$8  (via drill 0.6 pad 1.27)
  Top 0.813: LED6.2-DOUT v33.8,56.3 | v27.07,59.03 LED7.4-DIN
  Bottom 0.813: v33.8,56.3 v27.07,59.03
N$9  (via drill 0.6 pad 1.27)
  Top 0.813: LED7.2-DOUT 20.45,54.11 v18.92,54.51 | v12.49,53.36 LED8.4-DIN
  Bottom 0.813: v18.92,54.51 v12.49,53.36
N$10  (via drill 0.6 pad 1.27)
  Top 0.813: LED8.2-DOUT 9.32,45.6 v8.04,45.31 | v3.13,40.74 LED9.4-DIN
  Bottom 0.813: v8.04,45.31 v3.13,40.74
N$11  (via drill 0.6 pad 1.27)
  Top 0.813: LED9.2-DOUT 4.18,32.27 v3.14,31.57 | v1.24,25.98 LED10.4-DIN
  Bottom 0.813: v3.14,31.57 v1.24,25.98
N$12  (via drill 0.6 pad 1.27)
  Top 0.813: LED10.2-DOUT 6.4,19.36 v5.68,18 | v6.77,12.58 LED11.4-DIN
  Bottom 0.813: v5.68,18 v6.77,12.58
N$13  (via drill 0.6 pad 1.27)
  Top 0.813: LED11.2-DOUT 14.28,9.8 v13.96,8.21 | v16.65,4.14 LED12.4-DIN
  Bottom 0.813: v13.96,8.21 v16.65,4.14
VCC
  Top 0.61: C2.1 46.22,7.26 46.73,8.25 50.48,12.02 LED2.1-VDD 54.5,14.65 C3.1 54.92,17.81 54.79,18.54 56.21,22.66 LED3.1-VDD 58.73,25.47 C4.1 58.13,30.71 57.62,31.29 56.59,36.2 LED4.1-VDD 55.92,43.31 C5.1 53.92,45.14 53.11,45.21 49.62,49.01 LED5.1-VDD 46.07,54.17 C6.1 43.98,54.61 42.78,54.47 38.37,55.92 LED6.1-VDD 33.04,58.84 C7.1 29.56,58.25 28.39,57.66 23.1,56.55 LED7.1-VDD 17.17,56.16 C8.1 14.58,53.48 14.48,52.87 10.48,49.35 LED8.1-VDD 5.8,46.01 C9.1 4.87,42.48 4.86,40.97 3.29,35.76 LED9.1-VDD 1,31.38 C10.1 2.09,27.87 2.71,26.85 3.97,22.31 LED10.1-VDD 4.45,16.57 C11.1 6.57,14.19 7.5,14.22 11.35,9.88 LED11.1-VDD 13.74,5.93 C12.1 15.75,5.64 16.6,5.75 21.16,4.31 LED12.1-VDD | C2.1 44.61,5.27 LED1.1-VDD 39.45,4.4 35.93,3.29 C1.1 | C2.1 46.31,7.36
  Top 0.813: POWER.1 C1.1 | C4.1 58.19,29.49

### Text on the board
Top: - | + | D